# EAGLE design Thermostat_ADT6401_Breakout (EAGLE 9.6.2)
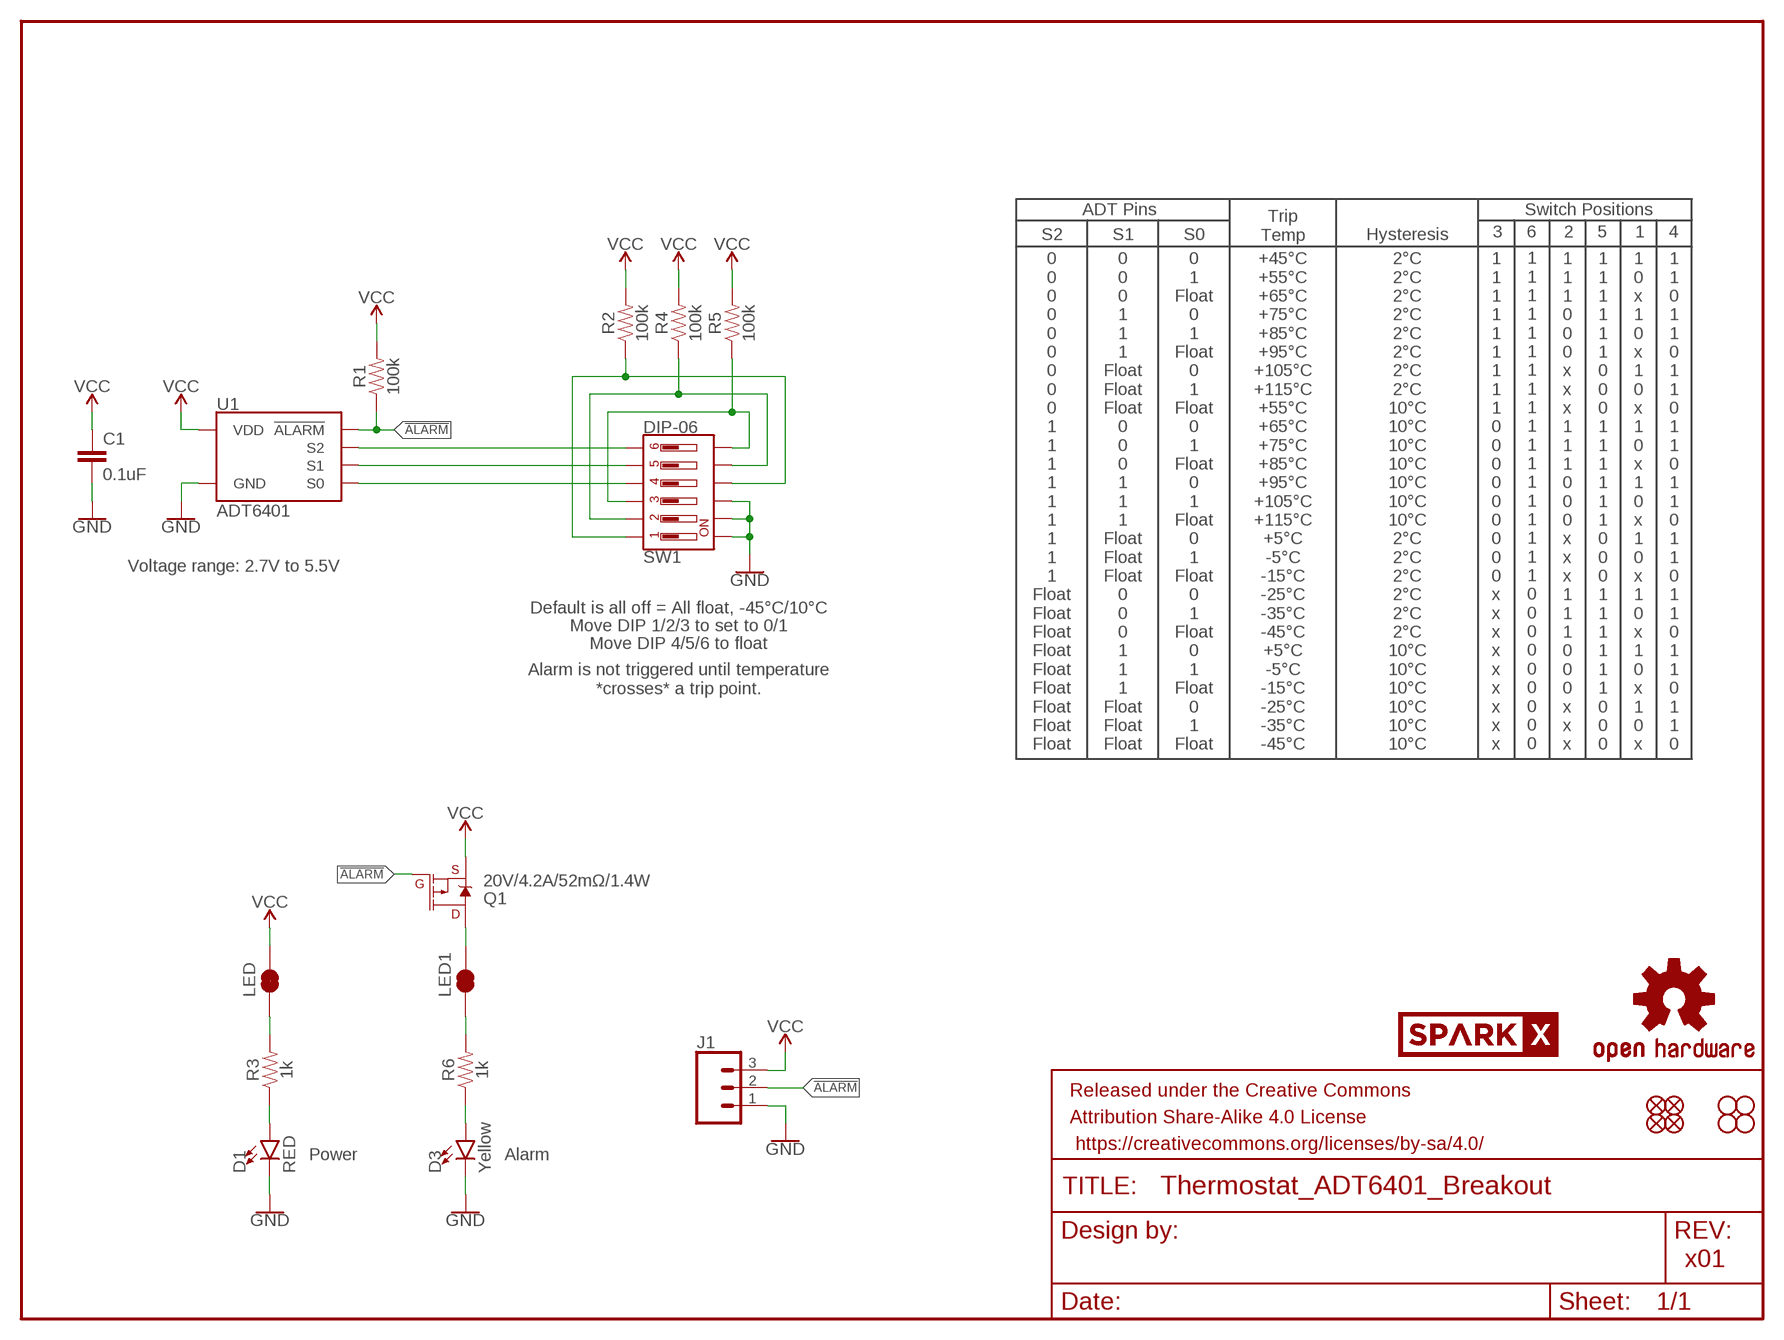
[diagram p0: schematic, sheet 1]

## Parts
C1  0.1uF  0.1UF-0603-25V-(+80/-20%)  [0603]
D1  RED  LED-RED0603  [LED-0603]
D3  Yellow  LED-YELLOW0603  [LED-0603]
FRAME1  FRAME-LETTER  [CREATIVE_COMMONS]
J1  CONN_031X03_NO_SILK  [1X03_NO_SILK]
JP1  FIDUCIAL1X2  [FIDUCIAL-1X2]
JP2  FIDUCIAL1X2  [FIDUCIAL-1X2]
JP3  STAND-OFF  [STAND-OFF]
JP4  STAND-OFF  [STAND-OFF]
JP5  FIDUCIAL1X2  [FIDUCIAL-1X2]
JP6  FIDUCIAL1X2  [FIDUCIAL-1X2]
JP8  STAND-OFF  [STAND-OFF]
JP9  STAND-OFF  [STAND-OFF]
LED  JUMPER-SMT_2_NC_TRACE_SILK  [SMT-JUMPER_2_NC_TRACE_SILK]
LED1  JUMPER-SMT_2_NC_TRACE_SILK  [SMT-JUMPER_2_NC_TRACE_SILK]
LOGO1  OSHW-LOGOMINI  [OSHW-LOGO-MINI]
Q1  20V/4.2A/52mΩ/1.4W  MOSFET_PCH-DMG2305UX-7  [SOT23-3]
R1  100k  100KOHM-0603-1/10W-1%  [0603]
R2  100k  100KOHM-0603-1/10W-1%  [0603]
R3  1k  1KOHM-0603-1/10W-1%  [0603]
R4  100k  100KOHM-0603-1/10W-1%  [0603]
R5  100k  100KOHM-0603-1/10W-1%  [0603]
R6  1k  1KOHM-0603-1/10W-1%  [0603]
SW1  DIP-06  [DIPSWITCH-06-SMD]
U1  ADT6401  [SOT23-6]
U$1  SPARKX-LOGO4  [SPARKX-MEDIUM]

## Nets
!ALARM!: J1.2 Q1.1(G) R1.1 U1.6(!ALARM!)
GND: C1.2 D1.C D3.C J1.1 SW1.10 SW1.11 SW1.12 U1.5(GND)
N$3: D1.A R3.1
N$4: LED.1 R3.2
N$5: LED1.2 Q1.3(D)
N$7: D3.A R6.1
N$8: LED1.1 R6.2
S0: SW1.4 U1.3(S0)
S0_PU: R2.1 SW1.1 SW1.9
S1: SW1.5 U1.2(S1)
S1_PU: R4.1 SW1.2 SW1.8
S2: SW1.6 U1.1(S2)
S2_PU: R5.1 SW1.3 SW1.7
VCC: C1.1 J1.3 LED.2 Q1.2(S) R1.2 R2.2 R4.2 R5.2 U1.4(VDD)

## Notes on the sheet
- ADT Pins | Switch Positions
- Trip
  Temp
- S2 | S1 | S0 | Hysteresis | 3 | 6 | 2 | 5 | 1 | 4
- 0
  0
  0
  0
  0
  0
  0
  0
  0
  1
  1
  1
  1
  1
  1
  1
  1
  1
  Float
  Float
  Float
  Float
  Float
  Float
  Float
  Float
  Float
- 0
  0
  0
  1
  1
  1
  Float
  Float
  Float
  0
  0
  0
  1
  1
  1
  Float
  Float
  Float
  0
  0
  0
  1
  1
  1
  Float
  Float
  Float
- 0
  1
  Float
  0
  1
  Float
  0
  1
  Float
  0
  1
  Float
  0
  1
  Float
  0
  1
  Float
  0
  1
  Float
  0
  1
  Float
  0
  1
  Float
- +45°C
  +55°C
  +65°C
  +75°C
  +85°C
  +95°C
  +105°C
  +115°C
  +55°C
  +65°C
  +75°C
  +85°C
  +95°C
  +105°C
  +115°C
  +5°C
  -5°C
  -15°C
  -25°C
  -35°C
  -45°C
  +5°C
  -5°C
  -15°C
  -25°C
  -35°C
  -45°C
- 2°C
  2°C
  2°C
  2°C
  2°C
  2°C
  2°C
  2°C
  10°C
  10°C
  10°C
  10°C
  10°C
  10°C
  10°C
  2°C
  2°C
  2°C
  2°C
  2°C
  2°C
  10°C
  10°C
  10°C
  10°C
  10°C
  10°C
- 1
  1
  1
  1
  1
  1
  1
  1
  1
  0
  0
  0
  0
  0
  0
  0
  0
  0
  x
  x
  x
  x
  x
  x
  x
  x
  x
- 1
  1
  1
  0
  0
  0
  x
  x
  x
  1
  1
  1
  0
  0
  0
  x
  x
  x
  1
  1
  1
  0
  0
  0
  x
  x
  x
- 1
  1
  1
  1
  1
  1
  0
  0
  0
  1
  1
  1
  1
  1
  1
  0
  0
  0
  1
  1
  1
  1
  1
  1
  0
  0
  0
- 1
  0
  x
  1
  0
  x
  1
  0
  x
  1
  0
  x
  1
  0
  x
  1
  0
  x
  1
  0
  x
  1
  0
  x
  1
  0
  x
- 1
  1
  0
  1
  1
  0
  1
  1
  0
  1
  1
  0
  1
  1
  0
  1
  1
  0
  1
  1
  0
  1
  1
  0
  1
  1
  0
- 1
  1
  1
  1
  1
  1
  1
  1
  1
  1
  1
  1
  1
  1
  1
  1
  1
  1
  0
  0
  0
  0
  0
  0
  0
  0
  0
- Voltage range: 2.7V to 5.5V
- Default is all off = All float, -45°C/10°C
- Move DIP 1/2/3 to set to 0/1
- Move DIP 4/5/6 to float
- Alarm is not triggered until temperature
  *crosses* a trip point.
- Power | Alarm
- x01

## Library data of the parts
C1 = SparkFun-Capacitors:0.1UF: 0.1µF ceramic capacitors A capacitor is a passive two-terminal electrical component used to store electrical energy temporarily in an electric field.; PROD_ID: CAP-00810
D1 = SparkFun-LED:LED-RED: Red SMD LED Used in manufacturing of most products at SparkFun Packages: 0603 - SMD 0603 package [Product Link] <http://docs.avagotech.com/docs/AV02-0551EN> 0603 SMART - SMD 0603 SMART package ( more efficient and expensive)[Product Link] <http://www.osram-os.com/Graphics/XPic2/00077099_0.pdf> 1206 - SMD1206 package [Product Link] <https://www.sparkfun.com/datasheets/DevTools/LilyPad/Q150OVS4.pdff> SparkFun Products: Pro Mini 328 -5V <https://www.sparkfun.com/products/821> RedBoard <https://www.sparkfun.com/products/12757> IOIO-OTG <https://www.sparkfun.com/products/13613>; PROD_ID: DIO-00819
D3 = SparkFun-LED:LED-YELLOW: Yellow SMD LED Used in manufacturing several products at SparkFun. Packages: 0603 - SMD 0603 package[Product Link] <http://www.kingbrightusa.com/product.asp?catalog_name=LED&product_id=APT1608SYCK> 0603 -SMART - SMART SMD 0603 package (more efficient/more expensive) [Product Link] <http://www.osram-os.com/osram_os/en/products/product-catalog/led-light-emitting-diodes/smartled-0603/ly-l29k/index.jsp> LilyPad - SMD1206 package[Product Datasheet] <https://www.sparkfun.com/datasheets/DevTools/LilyPad/Q150YUS4.pdf> SparkFun Products: Blynk Board <https://www.sparkfun.com/products/13794> IOIO-OTG <https://www.sparkfun.com/products/13613> XBee Explorer Serial <https://www.sparkfun.com/products/13225>; PROD_ID: DIO-09003
FRAME1 = SparkFun-Aesthetics:FRAME-LETTER: Schematic Frame - Letter Standard 8.5x11 US Letter frame
J1 = SparkFun-Connectors:CONN_03: Multi connection point. Often used as Generic Header-pin footprint for 0.1 inch spaced/style header connections On any of the 0.1 inch spaced packages, you can populate with these: Break Away Headers - Straight <https://www.sparkfun.com/products/116> (PRT-00116) Break Away Male Headers - Right Angle <https://www.sparkfun.com/products/553> (PRT-00553) Female Headers <https://www.sparkfun.com/products/115> (PRT-00115) Break Away Headers - Machine Pin <https://www.sparkfun.com/products/117> (PRT-00117) Break Away Female Headers - Swiss Machine Pin <https://www.sparkfun.com/products/743> (PRT-00743) Stackable Header - 3 Pin (Female, 0.1") <https://www.sparkfun.com/products/13875> (PRT-13875) For SCREWTERMINALS and SPRING TERMINALS visit here: Screw Terimnals on SparkFun.com <https://www.sparkfun.com/search/results?term=Screw+Terminals> (5mm/3.5mm/2.54mm spacing) This device is also useful as a general connection point to wire up your design to another part of your project. Our various solder wires solder well into these plated through hole pads. Hook-Up Wire - Assortment (Stranded, 22 AWG) <https://www.sparkfun.com/products/11375> (PRT-11375) Hook-Up Wire - Assortment (Solid Core, 22 AWG) <https://www.sparkfun.com/products/11367> (PRT-11367) View the entire wire category on our website here <https://www.sparkfun.com/categories/141> Special notes: Molex polarized connector foot print use with SKU : PRT-08232 with associated crimp pins and housings.
JP1 JP2 JP5 JP6 = SparkFun-Aesthetics:FIDUCIAL: Fiducial Alignment Points Point-of-reference for pick-and-place machines and other optical instruments.
JP3 JP4 JP8 JP9 = SparkFun-Hardware:STAND-OFF: Stand Off Drill holes for mechanically mounting via screws, standoffs, etc. Note: Use the keepout ring to avoid running the screw head into surrounding components. Variant Overviews STAND-OFF - Mechanical footprint for a #4 phillips button head screw. STAND-OFF-TIGHT - Mechanical footprint for a #4 phillips button head screw, Example SparkFun Products Screw - Phillips Head (1/4", 4-40, 10 pack) <https://www.sparkfun.com/products/10453> (PRT-10453) Screw - Phillips Head (1/2", 4-40, 10 pack) <https://www.sparkfun.com/products/10452> (PRT-10452) Screw - Phillips Head (3/4", 4-40, 10 pack) <https://www.sparkfun.com/products/10451> (PRT-10451) Screw - Phillips Head (1", 4-40, 10 pack) <https://www.sparkfun.com/products/10450> (PRT-10450)
LED LED1 = SparkFun-Jumpers:JUMPER-SMT_2_NC_TRACE: Normally closed trace jumper This jumper has a trace between two pads so it's normally closed (NC). Use a razor knife to open the connection. For best results follow the IPC guidelines for cutting traces: Cutout at least 0.063 mm (0.005 in). Remove all loose material to clean up the cut area. Seal the cut with an approved epoxy. Reapply solder to reclose the connection.
LOGO1 = SparkFun-Aesthetics:OSHW-LOGO: Open-Source Hardware (OSHW) Logo This logo indicates the piece of hardware it is found on incorporates a OSHW license and/or adheres to the definition of open source hardware found here: http://freedomdefined.org/OSHW
Q1 = SparkFun-DiscreteSemi:MOSFET_PCH: P-channel MOSFETs Voltage controlled devices that allow control of high current outputs. SparkFun Products: SparkFun ESP32 Thing <https://www.sparkfun.com/products/13907> SparkFun ESP8266 Thing <https://www.sparkfun.com/products/13231> SparkFun Pi Servo HAT V2 <https://www.sparkfun.com/products/15316> DMG2305UX-7 (20V/4.2A/SOT23-3); PROD_ID: TRAN-14388
R1 R2 R4 R5 = SparkFun-Resistors:100KOHM: 100kΩ resistor A resistor is a passive two-terminal electrical component that implements electrical resistance as a circuit element. Resistors act to reduce current flow, and, at the same time, act to lower voltage levels within circuits. - Wikipedia; PROD_ID: RES-07828
R3 R6 = SparkFun-Resistors:1KOHM: 1kΩ resistor A resistor is a passive two-terminal electrical component that implements electrical resistance as a circuit element. Resistors act to reduce current flow, and, at the same time, act to lower voltage levels within circuits. - Wikipedia; PROD_ID: RES-07856
SW1 = SparkFun-Switches:DIP-06; PROD_ID: SWCH-13756
U1 = ADT6401:ADT6401: Analog Devices ADT6401 Thermostat The ADT6401 is a configurable thermostat. When the ambient temperature falls over or under the defined temperature the alarm pin goes low.; PROD_ID: IC-15121
U$1 = SparkX:SPARKX-LOGO

## Net classes
1 power: width 0.203 mm

## Board
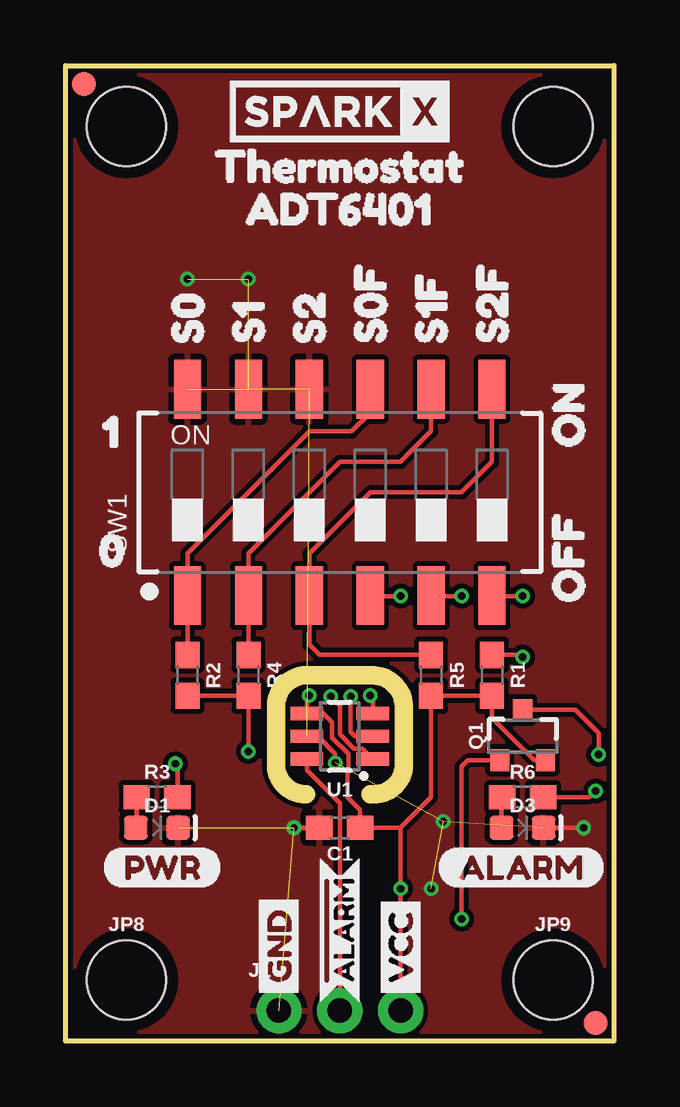
[diagram p1: board, top side]
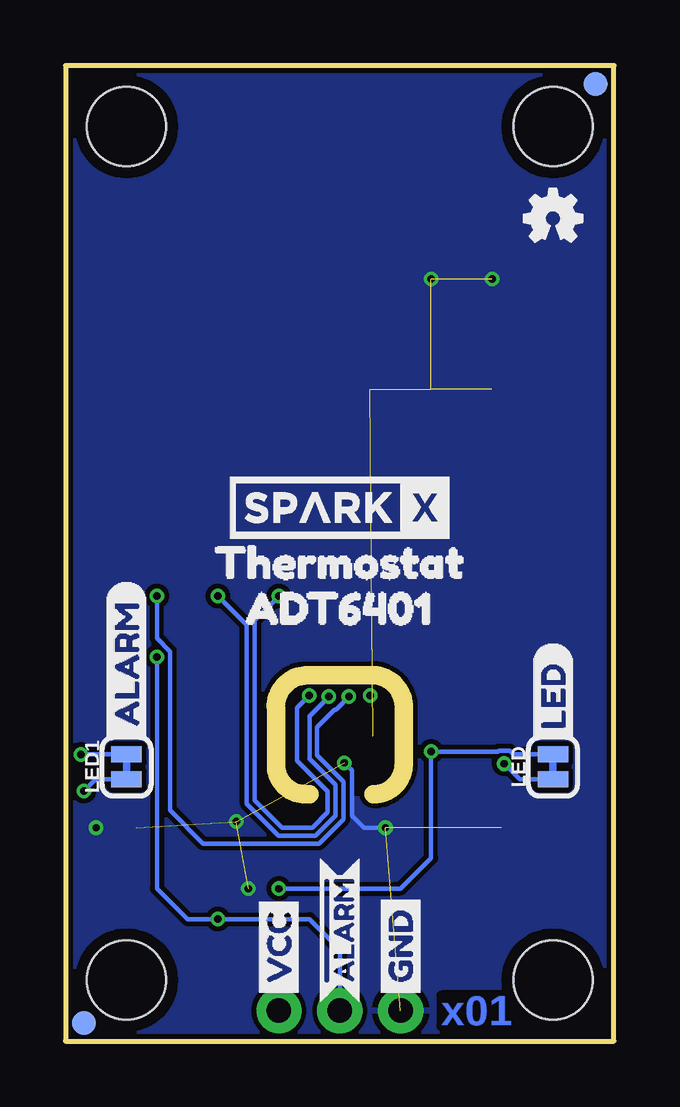
[diagram p2: board, bottom side, seen from below]

Size 22.86 x 40.64 mm. Coordinates in mm from the lower left corner, seen from the top.
Outline: 12.7,10.29 arc92 14.1,11.43 14.1,13.84 arc92 12.83,15.24 10.16,15.24 arc92 8.76,13.97 8.76,11.56 arc92 10.03,10.29
Outline: 0,0 0,40.64 22.86,40.64 22.86,0 0,0
Copper layers (1*16): Top 0.035mm / dielectric 1.5mm / Bottom 0.035mm
Design rules "SparkFun-2-layer-PCBWay-LIMIT": minimum track width 6mil, minimum drill 0.3mm, track to track 6mil, track to pad 6mil, pad to pad 6mil, via to via 6mil, smd to smd 6mil, copper to edge 6mil, drill to drill 6mil, minimum pad ring 6mil, minimum via ring 6mil, stop-mask expansion 4mil, vias tented up to drill 25mil, thermal gap 10mil

### Footprints (pad centres in the part's own frame; a part is rotated, then mirrored left to right if it is on the bottom)
0603 = smd 1.1 x 1: 1 -0.85,0; 2 0.85,0
LED-0603 = smd 1 x 1: A -0.877,0; C 0.877,0
1X03_NO_SILK = drill 1.016 pad 1.88: 1 0,0; 2 2.54,0; 3 5.08,0
FIDUCIAL-1X2 = smd 1 x 1: 1 0,0
STAND-OFF = hole 3.302: 0,0
SMT-JUMPER_2_NC_TRACE_SILK = smd 0.66 x 1.27: 1 -0.521,0; 2 0.521,0
SOT23-3 = smd 0.8 x 0.9: 1 -0.95,-1; 2 0.95,-1; 3 0,1.1
DIPSWITCH-06-SMD = smd 1.13 x 2.44: 1 -6.35,-4.3; 2 -3.81,-4.3; 3 -1.27,-4.3; 4 1.27,-4.3; 5 3.81,-4.3; 6 6.35,-4.3; 7 6.35,4.3; 8 3.81,4.3; 9 1.27,4.3; 10 -1.27,4.3; 11 -3.81,4.3; 12 -6.35,4.3
SOT23-6 = smd 0.55 x 1.35: 1 -0.95,-1.375; 2 0,-1.375; 3 0.95,-1.375; 4 0.95,1.375; 5 0,1.375; 6 -0.95,1.375

### Placement (x,y rotation side)
C1  11.43,8.89 180 top
D1  3.81,8.89 0 top
D3  19.05,8.89 0 top
FRAME1  -12.7,-19.05 0 top  (outside the outline)
J1  8.89,1.27 0 top
JP1  0.76,39.88 0 bottom
JP2  22.1,0.76 0 top
JP3  2.54,38.1 0 top
JP4  20.32,38.1 0 top
JP5  22.1,0.76 0 bottom
JP6  0.76,39.88 0 top
JP8  2.54,2.54 0 top
JP9  20.32,2.54 0 top
LED  2.54,11.43 90 bottom
LED1  20.32,11.43 90 bottom
LOGO1  2.54,34.29 0 bottom
Q1  19.05,12.7 0 top
R1  17.78,15.24 270 top
R2  5.08,15.24 270 top
R3  3.81,10.16 0 top
R4  7.62,15.24 270 top
R5  15.24,15.24 270 top
R6  19.05,10.16 0 top
SW1  11.43,22.86 0 top
U1  11.43,12.7 90 top
U$1  11.43,38.73 0 top
U$2  [01]  0.25,20.45 0 top
U$3  [#ALARM6]  11.43,1.4 90 top
U$4  [ADT64012]  16.51,18.03 0 bottom
U$5  [GND6]  8.89,1.52 90 top
U$6  [OFF3]  20.95,17.14 90 top
U$7  [ON2]  20.95,23.62 90 top
U$8  [10]  0.38,25.4 0 top
U$9  [THERMOSTAT0]  5.08,36.45 0 top
U$10  [(PWR)]  1.52,7.24 0 top
U$11  [VCC5]  13.97,1.52 90 top
U$12  [ADT64012]  6.35,34.67 0 top
U$13  [GND6]  8.89,1.52 90 bottom
U$14  [S1F5]  15.24,27.94 90 top
U$15  [#ALARM6]  11.43,1.4 90 bottom
U$16  [VCC5]  13.97,1.52 90 bottom
U$17  SPARKX-LOGO4  [SPARKX-MEDIUM]  11.43,22.23 0 bottom
U$18  [ORDERING_INSTRUCTIONS]  39.37,50.8 0 top  (outside the outline)
U$19  [THERMOSTAT0]  17.78,19.94 0 bottom
U$20  [ALARM1]  20.32,12.19 90 bottom
U$21  [S2F7]  17.78,27.94 90 top
U$22  [S12]  7.62,27.94 90 top
U$23  [S23]  10.16,27.94 90 top
U$24  [S00]  5.08,27.94 90 top
U$25  [S0F1]  12.7,27.94 90 top
U$26  [LED0]  2.54,12.06 90 bottom
U$27  [ALARM2]  15.49,7.24 0 top

### Tracks (layer width: path | path; a pad name or v marks a point on that pad's centre or on a via)
!ALARM!  (via drill 0.3)
  Top 0.178: J1.2 11.43,9.91 10.05,11.28 U1.6 | R1.1 18.96,16.09 v19.05,16 | Q1.1 16.78,11.7 16.51,11.43 v16.51,5.08
  Bottom 0.178: J1.2 11.43,3.81 12.7,5.08 v16.51,5.08 17.78,5.08 19.05,6.35 v19.05,16
GND  (via drill 0.3)  (10 unrouted)
  Top 0.178: U1.5 10.51,12.7 11.24,11.97 v11.24,11.59 | v9.53,8.89 C1.2 | D3.C v21.59,8.89
  Bottom 0.178: v9.53,8.89 10.41,8.89 10.92,9.4 10.92,11.28 v11.24,11.59
  other vias: 5.08,31.75 7.62,31.75 15.24,6.35 15.75,9.14
  pour Bottom (isolate 0.203): 0,0 0,40.64 22.86,40.64 22.86,0
  pour Top (isolate 0.203): 0,0 0,40.64 22.86,40.64 22.86,0
N$3
  Top 0.178: R3.1 2.96,8.92 D1.A
N$4  (via drill 0.3)
  Top 0.178: R3.2 4.66,11.47 v4.57,11.56
  Bottom 0.178: v4.57,11.56 3.92,10.91 LED.1
N$5  (via drill 0.3)
  Top 0.178: Q1.3 21.25,13.8 22.23,12.83 v22.23,11.94
  Bottom 0.178: LED1.2 22.21,11.95 v22.23,11.94
N$6
  cutout Bottom (isolate 0.305): 9.14,14.86 13.72,14.86 13.72,10.29 9.14,10.29
  cutout Top (isolate 0.305): 13.72,14.86 9.14,14.86 9.14,10.29 13.72,10.29
N$7
  Top 0.178: R6.1 18.17,10.13 D3.A
N$8  (via drill 0.3)
  Top 0.178: R6.2 21.84,10.16 v22.1,10.41
  Bottom 0.178: v22.1,10.41 21.6,10.91 LED1.1
S0  (via drill 0.3)
  Top 0.178: U1.3 12.8,14.3 v12.7,14.4 | v13.97,18.54 12.72,18.54 SW1.4
  Bottom 0.178: v12.7,14.4 13.21,13.89 13.21,11.68 11.94,10.41 11.94,9.53 12.57,8.89 13.84,8.89 14.99,10.03 14.99,17.53 v13.97,18.54
S0_PU
  Top 0.178: R2.1 SW1.1 5.08,20.32 10.16,25.4 11.92,25.4 12.7,26.18 SW1.9
S1  (via drill 0.3)
  Top 0.178: U1.2 12.06,12.7 11.89,12.88 v11.89,14.35 | v16.51,18.54 15.26,18.54 SW1.5
  Bottom 0.178: v11.89,14.35 12.7,13.54 12.7,11.77 11.61,10.68 11.61,9.39 12.44,8.56 13.98,8.56 15.32,9.9 15.32,17.35 v16.51,18.54
S1_PU
  Top 0.178: R4.1 SW1.2 7.62,20.32 11.43,24.13 13.97,24.13 15.24,25.4 SW1.8
S2  (via drill 0.3)
  Top 0.178: U1.1 12.37,12.18 12.03,12.18 11.43,12.78 11.43,13.97 v11.05,14.35 | v19.05,18.54 17.8,18.54 SW1.6
  Bottom 0.178: v19.05,18.54 19.05,16.77 18.5,16.23 18.5,9.61 17.12,8.23 12.3,8.23 11.28,9.25 11.28,10.81 12.37,11.91 12.37,13.08 11.65,13.8 11.59,13.8 11.27,14.12 11.27,14.13 v11.05,14.35
S2_PU
  Top 0.178: R5.1 10.58,16.09 10.16,16.51 SW1.3 10.16,20.32 12.7,22.86 16.51,22.86 17.78,24.13 SW1.7
VCC  (via drill 0.3)
  Top 0.178: R2.2 R4.2 v7.62,12.06 | J1.3 v13.97,6.35 13.97,8.89 | v10.16,14.4 10.05,14.3 U1.4 10.73,13.65 11.1,13.28 11.1,12.65 11.79,11.96 11.79,11.37 11.76,11.34 11.76,10.16 12.28,9.64 C1.1 13.97,8.89 | 13.97,8.89 15.24,10.16 R5.2 R1.2 17.78,13.46 19.54,11.7 Q1.2
  Bottom 0.178: v13.97,6.35 8.89,6.35 7.62,7.62 v7.62,12.06 4.84,12.06 4.8,12.1 4.35,12.1 4.19,11.95 LED.2

### Text on the board
Bottom: x01
tDocu: 0.8mm board